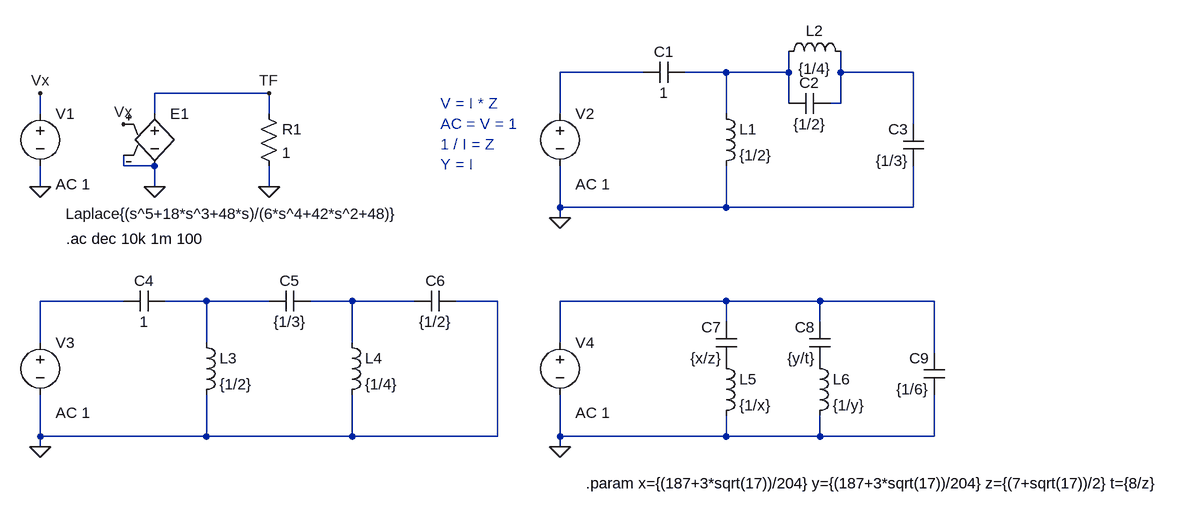
[diagram p0: schematic TS10_1.asc]
TS10_1.asc, the LTspice schematic file:
Version 4
SHEET 1 2976 1112
WIRE 880 448 752 448
WIRE 1008 448 944 448
WIRE 1104 448 1104 416
WIRE 1104 448 1008 448
WIRE 1184 448 1184 416
WIRE 1296 448 1184 448
WIRE 304 480 128 480
WIRE 1104 496 1104 448
WIRE 1184 496 1184 448
WIRE 1184 496 1168 496
WIRE -48 512 -48 480
WIRE 128 512 128 480
WIRE 304 512 304 480
WIRE 752 512 752 448
WIRE 1008 512 1008 448
WIRE 1296 528 1296 448
WIRE 80 592 80 576
WIRE 128 592 80 592
WIRE -48 624 -48 592
WIRE 128 624 128 592
WIRE 304 624 304 592
WIRE 752 656 752 592
WIRE 1008 656 1008 592
WIRE 1008 656 752 656
WIRE 1296 656 1296 592
WIRE 1296 656 1008 656
WIRE 752 672 752 656
WIRE 80 800 -48 800
WIRE 208 800 144 800
WIRE 304 800 208 800
WIRE 432 800 368 800
WIRE 528 800 432 800
WIRE 656 800 592 800
WIRE 1008 800 752 800
WIRE 1152 800 1008 800
WIRE 1328 800 1152 800
WIRE 1008 832 1008 800
WIRE 1152 832 1152 800
WIRE -48 864 -48 800
WIRE 208 864 208 800
WIRE 432 864 432 800
WIRE 752 864 752 800
WIRE 1328 880 1328 800
WIRE -48 1008 -48 944
WIRE 208 1008 208 944
WIRE 208 1008 -48 1008
WIRE 432 1008 432 944
WIRE 432 1008 208 1008
WIRE 656 1008 656 800
WIRE 656 1008 432 1008
WIRE 752 1008 752 944
WIRE 1008 1008 1008 976
WIRE 1008 1008 752 1008
WIRE 1152 1008 1152 976
WIRE 1152 1008 1008 1008
WIRE 1328 1008 1328 944
WIRE 1328 1008 1152 1008
WIRE -48 1024 -48 1008
WIRE 752 1024 752 1008
FLAG 128 624 0
FLAG -48 624 0
FLAG -48 480 Vx
FLAG 80 528 Vx
FLAG 304 624 0
FLAG 752 672 0
FLAG -48 1024 0
FLAG 752 1024 0
FLAG 304 480 TF
SYMBOL voltage -48 496 R0
WINDOW 123 24 124 Left 2
WINDOW 39 0 0 Left 0
SYMATTR Value2 AC 1
SYMATTR InstName V1
SYMATTR Value ""
SYMBOL e 128 496 R0
WINDOW 3 -137 170 Left 2
SYMATTR Value Laplace{(s^5+18*s^3+48*s)/(6*s^4+42*s^2+48)}
SYMATTR InstName E1
SYMBOL res 288 496 R0
SYMATTR InstName R1
SYMATTR Value 1
SYMBOL cap 944 432 R90
WINDOW 0 0 32 VBottom 2
WINDOW 3 32 32 VTop 2
SYMATTR InstName C1
SYMATTR Value 1
SYMBOL ind 992 496 R0
SYMATTR InstName L1
SYMATTR Value {1/2}
SYMBOL ind 1088 432 R270
WINDOW 0 32 56 VTop 2
WINDOW 3 5 56 VBottom 2
SYMATTR InstName L2
SYMATTR Value {1/4}
SYMBOL cap 1168 480 R90
WINDOW 0 0 32 VBottom 2
WINDOW 3 32 32 VTop 2
SYMATTR InstName C2
SYMATTR Value {1/2}
SYMBOL cap 1312 592 R180
WINDOW 0 24 56 Left 2
WINDOW 3 24 8 Left 2
SYMATTR InstName C3
SYMATTR Value {1/3}
SYMBOL voltage 752 496 R0
WINDOW 123 24 124 Left 2
WINDOW 39 0 0 Left 0
SYMATTR Value2 AC 1
SYMATTR InstName V2
SYMATTR Value ""
SYMBOL cap 144 784 R90
WINDOW 0 0 32 VBottom 2
WINDOW 3 32 32 VTop 2
SYMATTR InstName C4
SYMATTR Value 1
SYMBOL ind 192 848 R0
SYMATTR InstName L3
SYMATTR Value {1/2}
SYMBOL voltage -48 848 R0
WINDOW 123 24 124 Left 2
WINDOW 39 0 0 Left 0
SYMATTR Value2 AC 1
SYMATTR InstName V3
SYMATTR Value ""
SYMBOL cap 368 784 R90
WINDOW 0 0 32 VBottom 2
WINDOW 3 32 32 VTop 2
SYMATTR InstName C5
SYMATTR Value {1/3}
SYMBOL ind 416 848 R0
SYMATTR InstName L4
SYMATTR Value {1/4}
SYMBOL cap 592 784 R90
WINDOW 0 0 32 VBottom 2
WINDOW 3 32 32 VTop 2
SYMATTR InstName C6
SYMATTR Value {1/2}
SYMBOL cap 1024 896 R180
WINDOW 0 24 56 Left 2
WINDOW 3 24 8 Left 2
SYMATTR InstName C7
SYMATTR Value {x/z}
SYMBOL ind 992 880 R0
SYMATTR InstName L5
SYMATTR Value {1/x}
SYMBOL voltage 752 848 R0
WINDOW 123 24 124 Left 2
WINDOW 39 0 0 Left 0
SYMATTR Value2 AC 1
SYMATTR InstName V4
SYMATTR Value ""
SYMBOL cap 1168 896 R180
WINDOW 0 24 56 Left 2
WINDOW 3 24 8 Left 2
SYMATTR InstName C8
SYMATTR Value {y/t}
SYMBOL ind 1136 880 R0
SYMATTR InstName L6
SYMATTR Value {1/y}
SYMBOL cap 1344 944 R180
WINDOW 0 24 56 Left 2
WINDOW 3 24 8 Left 2
SYMATTR InstName C9
SYMATTR Value {1/6}
TEXT -8 704 Left 2 !.ac dec 10k 1m 100
TEXT 792 1080 Left 2 !.param x={(187+3*sqrt(17))/204} y={(187+3*sqrt(17))/204} z={(7+sqrt(17))/2} t={8/z}
TEXT 568 496 Left 2 ;V = I * Z\nAC = V = 1\n1 / I = Z\nY = I

The netlist it stands for:
* TS10_1.asc
V1 Vx 0 AC 1
E1 TF 0 Vx 0 Laplace{(s^5+18*s^3+48*s)/(6*s^4+42*s^2+48)}
R1 TF 0 1
C1 N002 N001 1
L1 N002 0 {1/2}
L2 N002 N003 {1/4}
C2 N003 N002 {1/2}
C3 0 N003 {1/3}
V2 N001 0 AC 1
C4 N005 N004 1
L3 N005 0 {1/2}
V3 N004 0 AC 1
C5 N006 N005 {1/3}
L4 N006 0 {1/4}
C6 0 N006 {1/2}
C7 P001 N007 {x/z}
L5 P001 0 {1/x}
V4 N007 0 AC 1
C8 P002 N007 {y/t}
L6 P002 0 {1/y}
C9 0 N007 {1/6}
.ac dec 10k 1m 100
.param x={(187+3*sqrt(17))/204} y={(187+3*sqrt(17))/204} z={(7+sqrt(17))/2} t={8/z}
* V = I * Z
* AC = V = 1
* 1 / I = Z
* Y = I
.backanno
.end